# Altium project cyber60-alps.PrjPcb
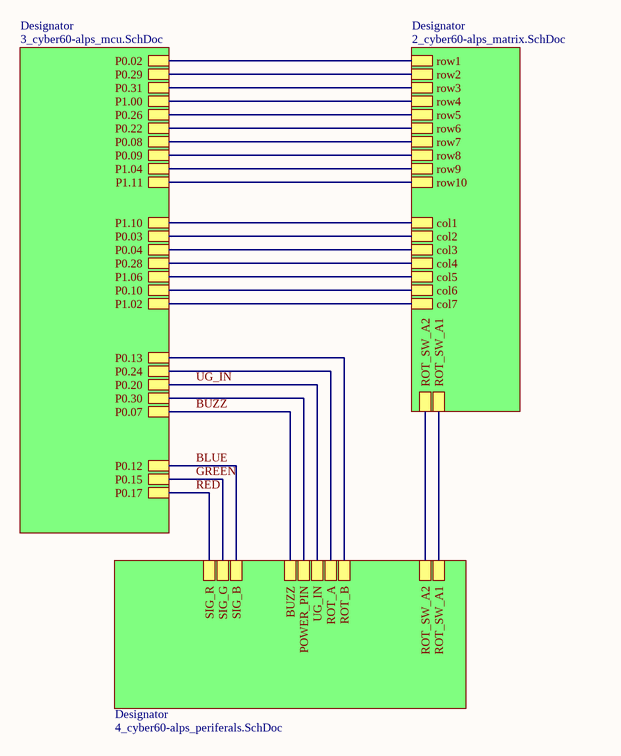
[diagram p0: 1_cyber60-alps_top.SchDoc]
ProjectTitle: cyber60; Revision: E1-ALPS
4 sheets, 243 parts. Net scope: hierarchical (ports join the sheet entries above them; power ports are global).
Board file: cyber60-alps.PcbDoc
Sheets:
  1_cyber60-alps_top.SchDoc
    Designator = 3_cyber60-alps_mcu.SchDoc
    Designator = 2_cyber60-alps_matrix.SchDoc
    Designator = 4_cyber60-alps_periferals.SchDoc

## Sheet 1_cyber60-alps_top.SchDoc: =ProjectTitle
size A4; Engineer: 4pplet; Address1: github.com/4pplet/cyber60; Address2: Licence: CERN-OHL-S; Revision: E1-ALPS; SheetNumber: 1; SheetTotal: 5; ProjectName: waffling60

### Sub-sheets
Designator = 3_cyber60-alps_mcu.SchDoc: P1.02, P1.04, P1.06, P1.11, P1.10, P0.07, P1.00, P0.22, P0.10, P0.09, P0.31, P0.29, P0.04, P0.02, P0.28, P0.20, P0.03, P0.26, P0.17, P0.15, P0.13, P0.24, P0.30, P0.12, P0.08
Designator = 2_cyber60-alps_matrix.SchDoc: col6, col5, col7, col3, col2, col1, col4, row3, row1, row4, row2, row5, row6, row9, row7, ROT_SW_A1, ROT_SW_A2, row8, row10
Designator = 4_cyber60-alps_periferals.SchDoc: ROT_SW_A2, ROT_B, ROT_A, ROT_SW_A1, POWER_PIN, BUZZ, SIG_B, SIG_R, SIG_G, UG_IN

### Nets
BLUE: sheet Designator/P0.12, sheet Designator/SIG_B
BUZZ: sheet Designator/P0.07, sheet Designator/BUZZ
col1: sheet Designator/P1.10, sheet Designator/col1
col2: sheet Designator/P0.03, sheet Designator/col2
col3: sheet Designator/P0.04, sheet Designator/col3
col4: sheet Designator/P0.28, sheet Designator/col4
col5: sheet Designator/P1.06, sheet Designator/col5
col6: sheet Designator/P0.10, sheet Designator/col6
col7: sheet Designator/P1.02, sheet Designator/col7, sheet Designator/ROT_SW_A2, sheet Designator/ROT_SW_A2
ENC_A: sheet Designator/P0.24, sheet Designator/ROT_A
ENC_B: sheet Designator/P0.13, sheet Designator/ROT_B
GREEN: sheet Designator/P0.15, sheet Designator/SIG_G
P0.02/AIN0: sheet Designator/P0.02, sheet Designator/row1
P0.08: sheet Designator/P0.08, sheet Designator/row7
P0.09/NFC1: sheet Designator/P0.09, sheet Designator/row8
P0.22: sheet Designator/P0.22, sheet Designator/row6
P0.26: sheet Designator/P0.26, sheet Designator/row5
P0.29/AIN5: sheet Designator/P0.29, sheet Designator/row2
P0.30/AIN6: sheet Designator/P0.30, sheet Designator/POWER_PIN
P0.31/AIN7: sheet Designator/P0.31, sheet Designator/row3
P1.00: sheet Designator/P1.00, sheet Designator/row4
P1.04: sheet Designator/P1.04, sheet Designator/row9
P1.11: sheet Designator/P1.11, sheet Designator/row10
RED: sheet Designator/P0.17, sheet Designator/SIG_R  [project net P0.17]
ROT_SW_A1: sheet Designator/ROT_SW_A1, sheet Designator/ROT_SW_A1
UG_IN: sheet Designator/P0.20, sheet Designator/UG_IN  [project net P0.20]

### Notes on the sheet
- Title
- Size:
- Date:
- A4
- Number:
- Time:
- Revision:
- Sheet
- of
- File:

## Sheet 3_cyber60-alps_mcu.SchDoc: =ProjectTitle
size A3; Address1: github.com/4pplet/cyber60; Address2: Licence: CERN-OHL-S; Revision: E1-ALPS; SheetNumber: 3; SheetTotal: 5
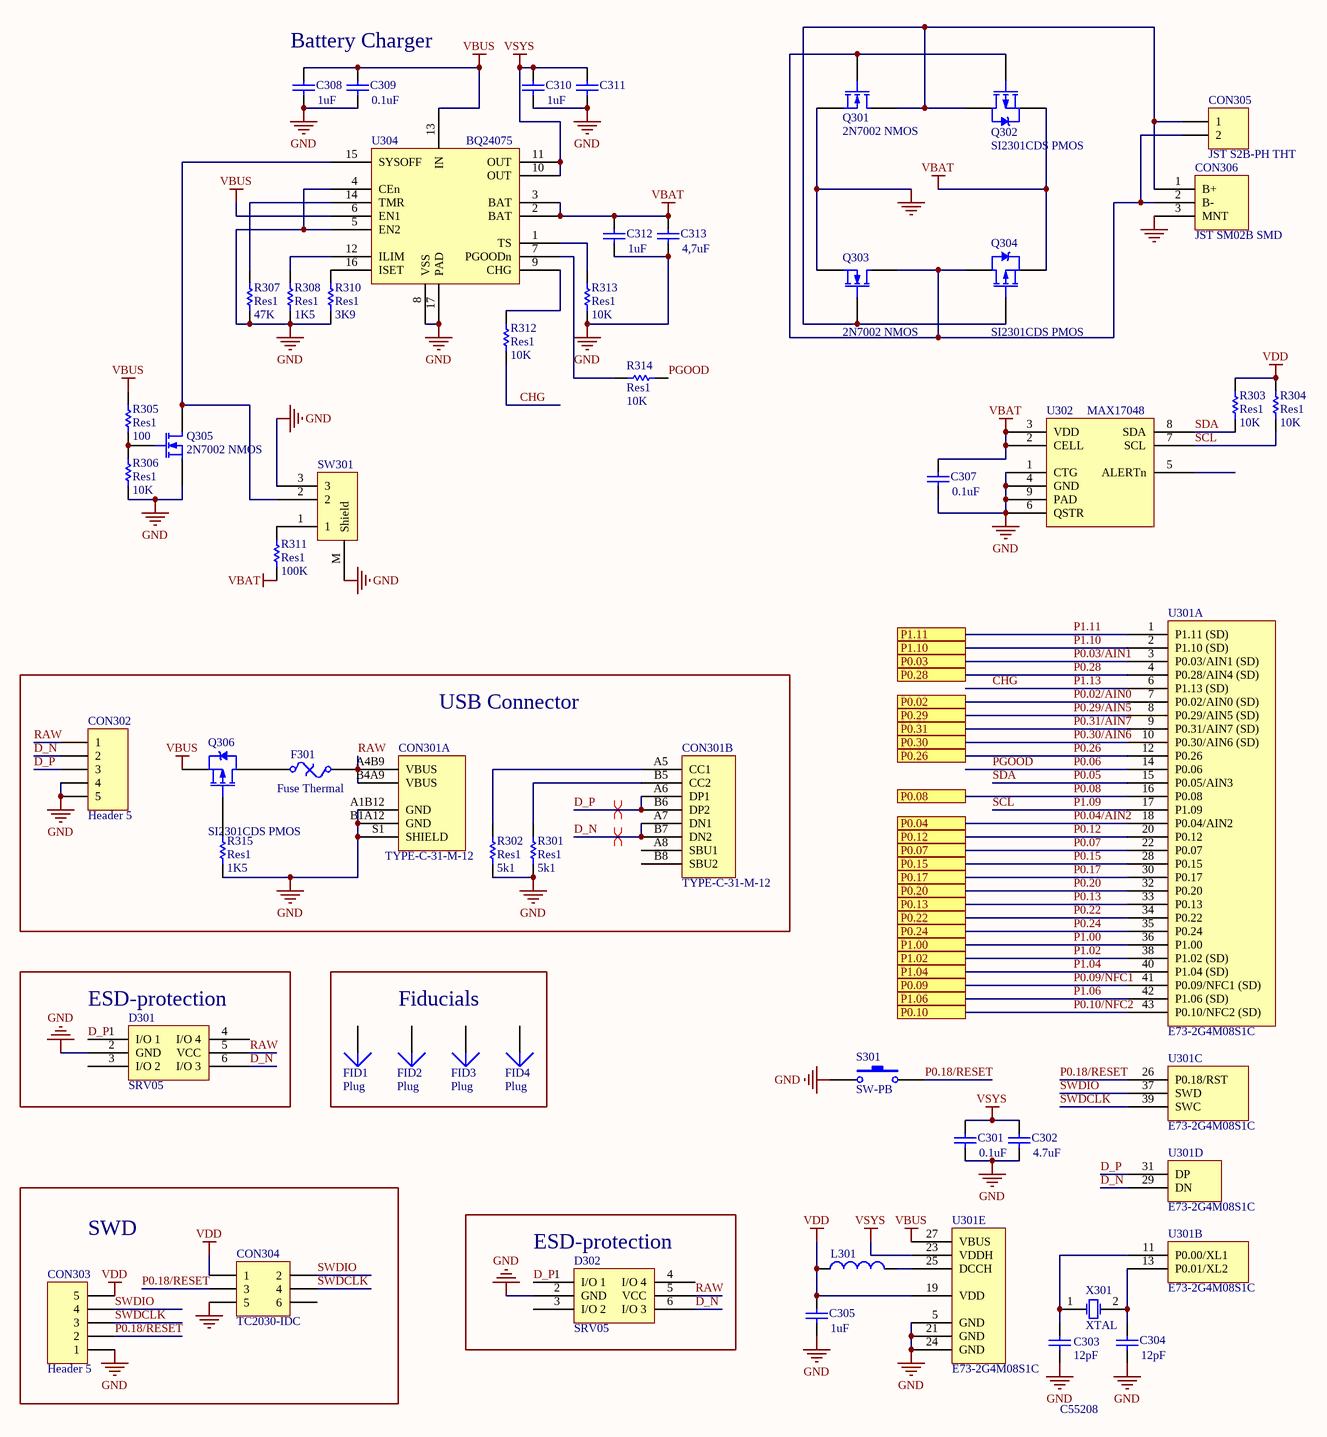
[diagram p1: 3_cyber60-alps_mcu.SchDoc]

### Parts
C301  value 0.1uF  [C0603[1608]]
C302  value 4.7uF  [C0603[1608]]
C303  value 12pF  [C0402[1005]]
C304  value 12pF  [C0402[1005]]
C305  value 1uF  [C0603[1608]]
C307  value 0.1uF  [C0603[1608]]
C308  value 1uF  [C0603[1608]]
C309  value 0.1uF  [C0603[1608]]
C310  value 1uF  [C0603[1608]]
C311  (no value)  [C0603[1608]]
C312  value 1uF  [C0603[1608]]
C313  value 4,7uF  [C0603[1608]]
CON301  TYPE-C-31-M-12  [TYPE-C-31-M-12]  (parts A,B of 2)
CON302  Header 5  [UDB_COMBO_JST_MOLEX]
CON303  Header 5  [HDR1X5]  (no BOM)
CON304  TC2030-IDC  [TC2030-IDC-NL]  (no BOM)
CON305  JST S2B-PH THT  [JST S2B-PH-K(LF)(SN)]  (no BOM)
CON306  JST SM02B SMD  [JST SM02B-SRSS-TB]
D301  SRV05  [SOT-23-6]
D302  SRV05  [SOT-23-6]
F301  Fuse Thermal  [C1206[3216]]
FID1  Plug  [Fiducial_Nordic]  (no BOM)
FID2  Plug  [Fiducial_Nordic]  (no BOM)
FID3  Plug  [Fiducial_Nordic]  (no BOM)
FID4  Plug  [Fiducial_Nordic]  (no BOM)
L301  Inductor  [L0603[1608]]  (value not drawn)
Q301  2N7002 NMOS  [SOT-23-3]
Q302  SI2301CDS PMOS  [SOT-23-3]
Q303  2N7002 NMOS  [SOT-23-3]
Q304  SI2301CDS PMOS  [SOT-23-3]
Q305  2N7002 NMOS  [SOT-23-3]
Q306  SI2301CDS PMOS  [SOT-23-3]
R301  Res1  value 5k1  [R0603[1608]]
R302  Res1  value 5k1  [R0603[1608]]
R303  Res1  value 10K  [R0603[1608]]
R304  Res1  value 10K  [R0603[1608]]
R305  Res1  value 100  [R0603[1608]]
R306  Res1  value 10K  [R0603[1608]]
R307  Res1  value 47K  [R0603[1608]]
R308  Res1  value 1K5  [R0603[1608]]
R310  Res1  value 3K9  [R0603[1608]]
R311  Res1  value 100K  [R0603[1608]]
R312  Res1  value 10K  [R0603[1608]]
R313  Res1  value 10K  [R0603[1608]]
R314  Res1  value 10K  [R0603[1608]]
R315  Res1  value 1K5  [R0603[1608]]
S301  SW-PB  [XKB Switch]
SW301  Korean Hroparts Elec K3-1296S-E2  [Korean Hroparts Elec K3-1296S-E2]  (value not drawn)
U301  E73-2G4M08S1C  [E73-2G4M08S1C]  (parts A,B,C,D,E of 5)
U302  MAX17048  [8TDFN]
U304  BQ24075  [QFN16]
X301  XTAL  [XTAL-2012]

### Blocks framed on the sheet
USB Connector: CON301 CON302 F301 Q306 R301 R302 R315
ESD-protection: D301
Fiducials: FID1-FID4
SWD: CON303 CON304
ESD-protection: D302

### Ports
P0.02, P0.03, P0.04, P0.07, P0.08, P0.09, P0.10, P0.12, P0.13, P0.15, P0.17, P0.20, P0.22, P0.24, P0.26, P0.28, P0.29, P0.30, P0.31, P1.00, P1.02, P1.04, P1.06, P1.10, P1.11

### Nets
GND: C301.1 C302.1 C303.1 C304.1 C305.1 C307.1 C308.1 C309.1 C310.1 C311.1 C312.1 C313.1 CON301.A1B12(GND) CON301.B1A12(GND) CON301.S1(SHIELD) CON302.4 CON302.5 CON303.1 CON304.5 CON306.3(MNT) D301.2(GND) D302.2(GND) Q301.2(S) Q303.2(S) Q305.2(S) R301.2 R302.2 R306.2 R307.2 R308.2 R310.2 R313.2 R315.2 S301.1 SW301.3 SW301.M(Shield) U301.5(GND) U301.21(GND) U301.24(GND) U302.1(CTG) U302.4(GND) U302.6(QSTR) U302.9(PAD) U304.4(CEn) U304.5(EN2) U304.8(VSS) U304.17(PAD)
VBAT: C307.2 C312.2 C313.2 Q302.2(S) Q304.2(S) R311.2 U302.2(CELL) U302.3(VDD) U304.2(BAT) U304.3(BAT)
VBUS: C308.2 C309.2 Q306.2(S) R305.1 U301.27(VBUS) U304.6(EN1) U304.13(IN)
VDD: C305.2 CON303.5 CON304.1 L301.1 R303.1 R304.1 U301.19(VDD)
VSYS: C301.2 C302.2 C310.2 C311.2 U301.23(VDDH) U304.10(OUT) U304.11(OUT)
CHG: R312.2 U301.6(P1.13_(SD))  [also labelled P1.13]
D_N: CON301.A7(DN1) CON301.B7(DN2) CON302.2 D301.6(I/O_3) D302.6(I/O_3) U301.29(DN)
D_P: CON301.A6(DP1) CON301.B6(DP2) CON302.3 D301.1(I/O_1) D302.1(I/O_1) U301.31(DP)
P0.02/AIN0: U301.7(P0.02/AIN0_(SD)) ; port P0.02
P0.03/AIN1: U301.3(P0.03/AIN1_(SD)) ; port P0.03  [project net col2]
P0.04/AIN2: U301.18(P0.04/AIN2) ; port P0.04  [project net col3]
P0.05: R303.2 U301.15(P0.05/AIN3) U302.8(SDA)  [also labelled SDA]
P0.06: R314.2 U301.14(P0.06)  [also labelled PGOOD]
P0.07: U301.22(P0.07) ; port P0.07  [project net BUZZ]
P0.08: U301.16(P0.08) ; port P0.08
P0.09/NFC1: U301.41(P0.09/NFC1_(SD)) ; port P0.09
P0.10/NFC2: U301.43(P0.10/NFC2_(SD)) ; port P0.10  [project net col6]
P0.12: U301.20(P0.12) ; port P0.12  [project net BLUE]
P0.13: U301.33(P0.13) ; port P0.13  [project net ENC_B]
P0.15: U301.28(P0.15) ; port P0.15  [project net GREEN]
P0.17: U301.30(P0.17) ; port P0.17
P0.18/RESET: CON303.2 CON304.3 S301.2 U301.26(P0.18/RST)
P0.20: U301.32(P0.20) ; port P0.20
P0.22: U301.34(P0.22) ; port P0.22
P0.24: U301.35(P0.24) ; port P0.24  [project net ENC_A]
P0.26: U301.12(P0.26) ; port P0.26
P0.28: U301.4(P0.28/AIN4_(SD)) ; port P0.28  [project net col4]
P0.29/AIN5: U301.8(P0.29/AIN5_(SD)) ; port P0.29
P0.30/AIN6: U301.10(P0.30/AIN6_(SD)) ; port P0.30
P0.31/AIN7: U301.9(P0.31/AIN7_(SD)) ; port P0.31
P1.00: U301.36(P1.00) ; port P1.00
P1.02: U301.38(P1.02_(SD)) ; port P1.02  [project net col7]
P1.04: U301.40(P1.04_(SD)) ; port P1.04
P1.06: U301.42(P1.06_(SD)) ; port P1.06  [project net col5]
P1.09: R304.2 U301.17(P1.09) U302.7(SCL)  [also labelled SCL]
P1.10: U301.2(P1.10_(SD)) ; port P1.10  [project net col1]
P1.11: U301.1(P1.11_(SD)) ; port P1.11
RAW: CON301.A4B9(VBUS) CON301.B4A9(VBUS) CON302.1 D301.5(VCC) D302.5(VCC) F301.2
SWDCLK: CON303.3 CON304.4 U301.39(SWC)
SWDIO: CON303.4 CON304.2 U301.37(SWD)
NetC303_2: C303.2 U301.11(P0.00/XL1) X301.1(OSC1)
NetC304_2: C304.2 U301.13(P0.01/XL2) X301.2(OSC2)
NetCON301_A5: CON301.A5(CC1) R302.1
NetCON301_B5: CON301.B5(CC2) R301.1
NetCON305_1: CON305.1 CON306.1(B+) Q301.3(D) Q302.3(D) Q303.1(G) Q304.1(G)
NetCON305_2: CON305.2 CON306.2(B-) Q301.1(G) Q302.1(G) Q303.3(D) Q304.3(D)
NetF301_1: F301.1 Q306.3(D)
NetL301_2: L301.2 U301.25(DCCH)
NetQ305_1: Q305.1(G) R305.2 R306.1
NetQ305_3: Q305.3(D) SW301.2 U304.15(SYSOFF)
NetQ306_1: Q306.1(G) R315.1
NetR307_1: R307.1 U304.14(TMR)
NetR308_1: R308.1 U304.12(ILIM)
NetR310_1: R310.1 U304.16(ISET)
NetR311_1: R311.1 SW301.1
NetR312_1: R312.1 U304.9(CHG)
NetR313_1: R313.1 U304.1(TS)
NetR314_1: R314.1 U304.7(PGOODn)

Not connected (* = marked no-connect by the designer): CON301 A8(SBU1) B8(SBU2); CON304 6; D301 3(I/O_2) 4(I/O_4); D302 3(I/O_2) 4(I/O_4); FID1 1; FID2 1; FID3 1; FID4 1; U302 5(ALERTn)

### Layout directives
differential pair: D_N, D_P

### Notes on the sheet
- Battery Charger
- C55208
- Title
- Size:
- Date:
- File:
- A0
- Number:
- Time:
- Revision:
- Sheet
- of

### Library data of the parts
C301 C307 C309 = Cap: Capacitor; MRF.Part: CC0603KRX7R9BB104; LCSC MFG: YAGEO; Version: 0603 imperial; LCSC Part #: C14663
C302 C311 C313 = Cap: Capacitor; MRF.Part: CL10A475KO8NNNC; LCSC MFG: Samsung Electro-Mechanics; LCSC Part #: C19666
  C302: Version: 0603 imperial
C303 C304 = Cap: Capacitor; MRF.Part: 0402CG120J500NT; LCSC MFG: FH (Guangdong Fenghua Advanced Tech); Version: 0402; LCSC Part #: C1547
C305 C308 C310 C312 = Cap: Capacitor; MRF.Part: CL10A105KB8NNNC; LCSC MFG: Samsung Electro-Mechanics; Version: 0603 imperial; LCSC Part #: C15849
CON301 = TYPE-C-31-M-12: MFG: Korean Hroparts Elec; MFGPN: TYPE-C-31-M-12; LCSC Part #: C165948; LCSC MFG: Korean Hroparts Elec; MRF.Part: TYPE-C-31-M-12
CON302 = Header 5: JST for USB daughter board; MFGPN: SM04B-SRSS-TB(LF)(SN); MFG: JST Sales America Inc.; LCSC MFG: JST Sales America; LCSC Part #: C160404; MRF.Part: SM04B-SRSS-TB(LF)(SN)
CON303 = Header 5: Header, 5-Pin
CON304 = Header 3X2: Header, 3-Pin, Dual row
CON305 = Header 2: Header, 2-Pin; MRF.Part: S2B-PH-K(LF)(SN); LCSC MFG: JST Sales America; LCSC Part #: C265016
CON306 = JST S2B-PH-SM4-TB: MRF.Part: SM02B-SRSS-TB(LF)(SN); LCSC MFG: JST Sales America; LCSC Part #: C160402
D301 D302 = SRV05: MRF.Part: SRV05-4-P-T7; LCSC MFG: ProTek Devices; LCSC Part #: C85364
F301 = Fuse Thermal: Thermal Fuse; MRF.Part: ASMD1206-050; MFG: Bel Fuse Inc.; MFGPN: 0ZCJ0050FF2G; LCSC MFG: Shenzhen JDT Fuse; LCSC Part #: C135338
L301 = Inductor: MRF.Part: CBMF1608T100K; LCSC MFG: Taiyo Yuden; LCSC Part #: C92982
Q301 Q303 Q305 = MOSFET-N: N-Channel MOSFET; LCSC MFG: Changjiang Electronics Tech (CJ); LCSC Part #: C8545; MRF.Part: 2N7002
Q302 Q304 Q306 = PMOS-2: P-Channel Power MOSFET; MRF.Part: SI2301CDS-T1-GE3; Note: Pin 4 not drawn and electrically connected to Pin 2.; LCSC MFG: Vishay Intertech; LCSC Part #: C10487
R301 R302 = Res1: Resistor; MRF.Part: 0603WAF5101T5E; MFG: Panasonic Electronic Components; MFGPN: ERJ-3EKF5101V; LCSC MFG: Uniroyal Elec; Version: 0603 imperial; LCSC Part #: C23186
R303 R304 R306 R311-R314 = Res1: Resistor; MRF.Part: 0603WAF1002T5E; LCSC MFG: Uniroyal Elec; Version: 0603 imperial; LCSC Part #: C25804
R305 = Res1: Resistor; MRF.Part: 0603WAF1000T5E; LCSC MFG: UNI-ROYAL(Uniroyal Elec); Version: 0603 imperial; LCSC Part #: C22775
R307 = Res1: Resistor; MRF.Part: 0603WAF4702T5E; LCSC MFG: UNI-ROYAL(Uniroyal Elec); Version: 0603 imperial; LCSC Part #: C25819
R308 R315 = Res1: Resistor; MRF.Part: 0603WAF1501T5E; LCSC MFG: UNI-ROYAL(Uniroyal Elec); Version: 0603 imperial; LCSC Part #: C22843
R310 = Res1: Resistor; MRF.Part: 0603WAF3901T5E; LCSC MFG: UNI-ROYAL(Uniroyal Elec); Version: 0603 imperial; LCSC Part #: C23018
S301 = SW-PB: Switch; MRF.Part: TS-1187A-C-D-B; LCSC MFG: XKB Enterprise; LCSC Part #: C318888
U301 = E73-2G4M08S1C: LCSC MFG: Chengdu Ebyte Elec Tech; LCSC Part #: C356849; MRF.Part: E73-2G4M08S1C
U302 = MAX17048: MRF.Part: MAX17048G+T10; LCSC MFG: Analog Devices Inc./Maxim Integrated; LCSC Part #: C2682616
U304 = BQ24075: MRF.Part: BQ24075RGTR; LCSC MFG: Texas Instruments; LCSC Part #: C15464
X301 = XTAL: Crystal Oscillator; MRF.Part: X1A0000610002; Value: 32.768KHz; LCSC MFG: Seiko Epson; Version: 3225, 18pF; LCSC Part #: C55208
SW301 = Korean Hroparts Elec K3-1296S-E2: LCSC MFG: Korean Hroparts Elec; LCSC Part #: C136659; MFGPN: K3-1296S-E2

## Sheet 2_cyber60-alps_matrix.SchDoc: =ProjectTitle
size A3; Address1: github.com/4pplet/cyber60; Address2: Licence: CERN-OHL-S; Revision: E1-ALPS; SheetNumber: 2; SheetTotal: 5
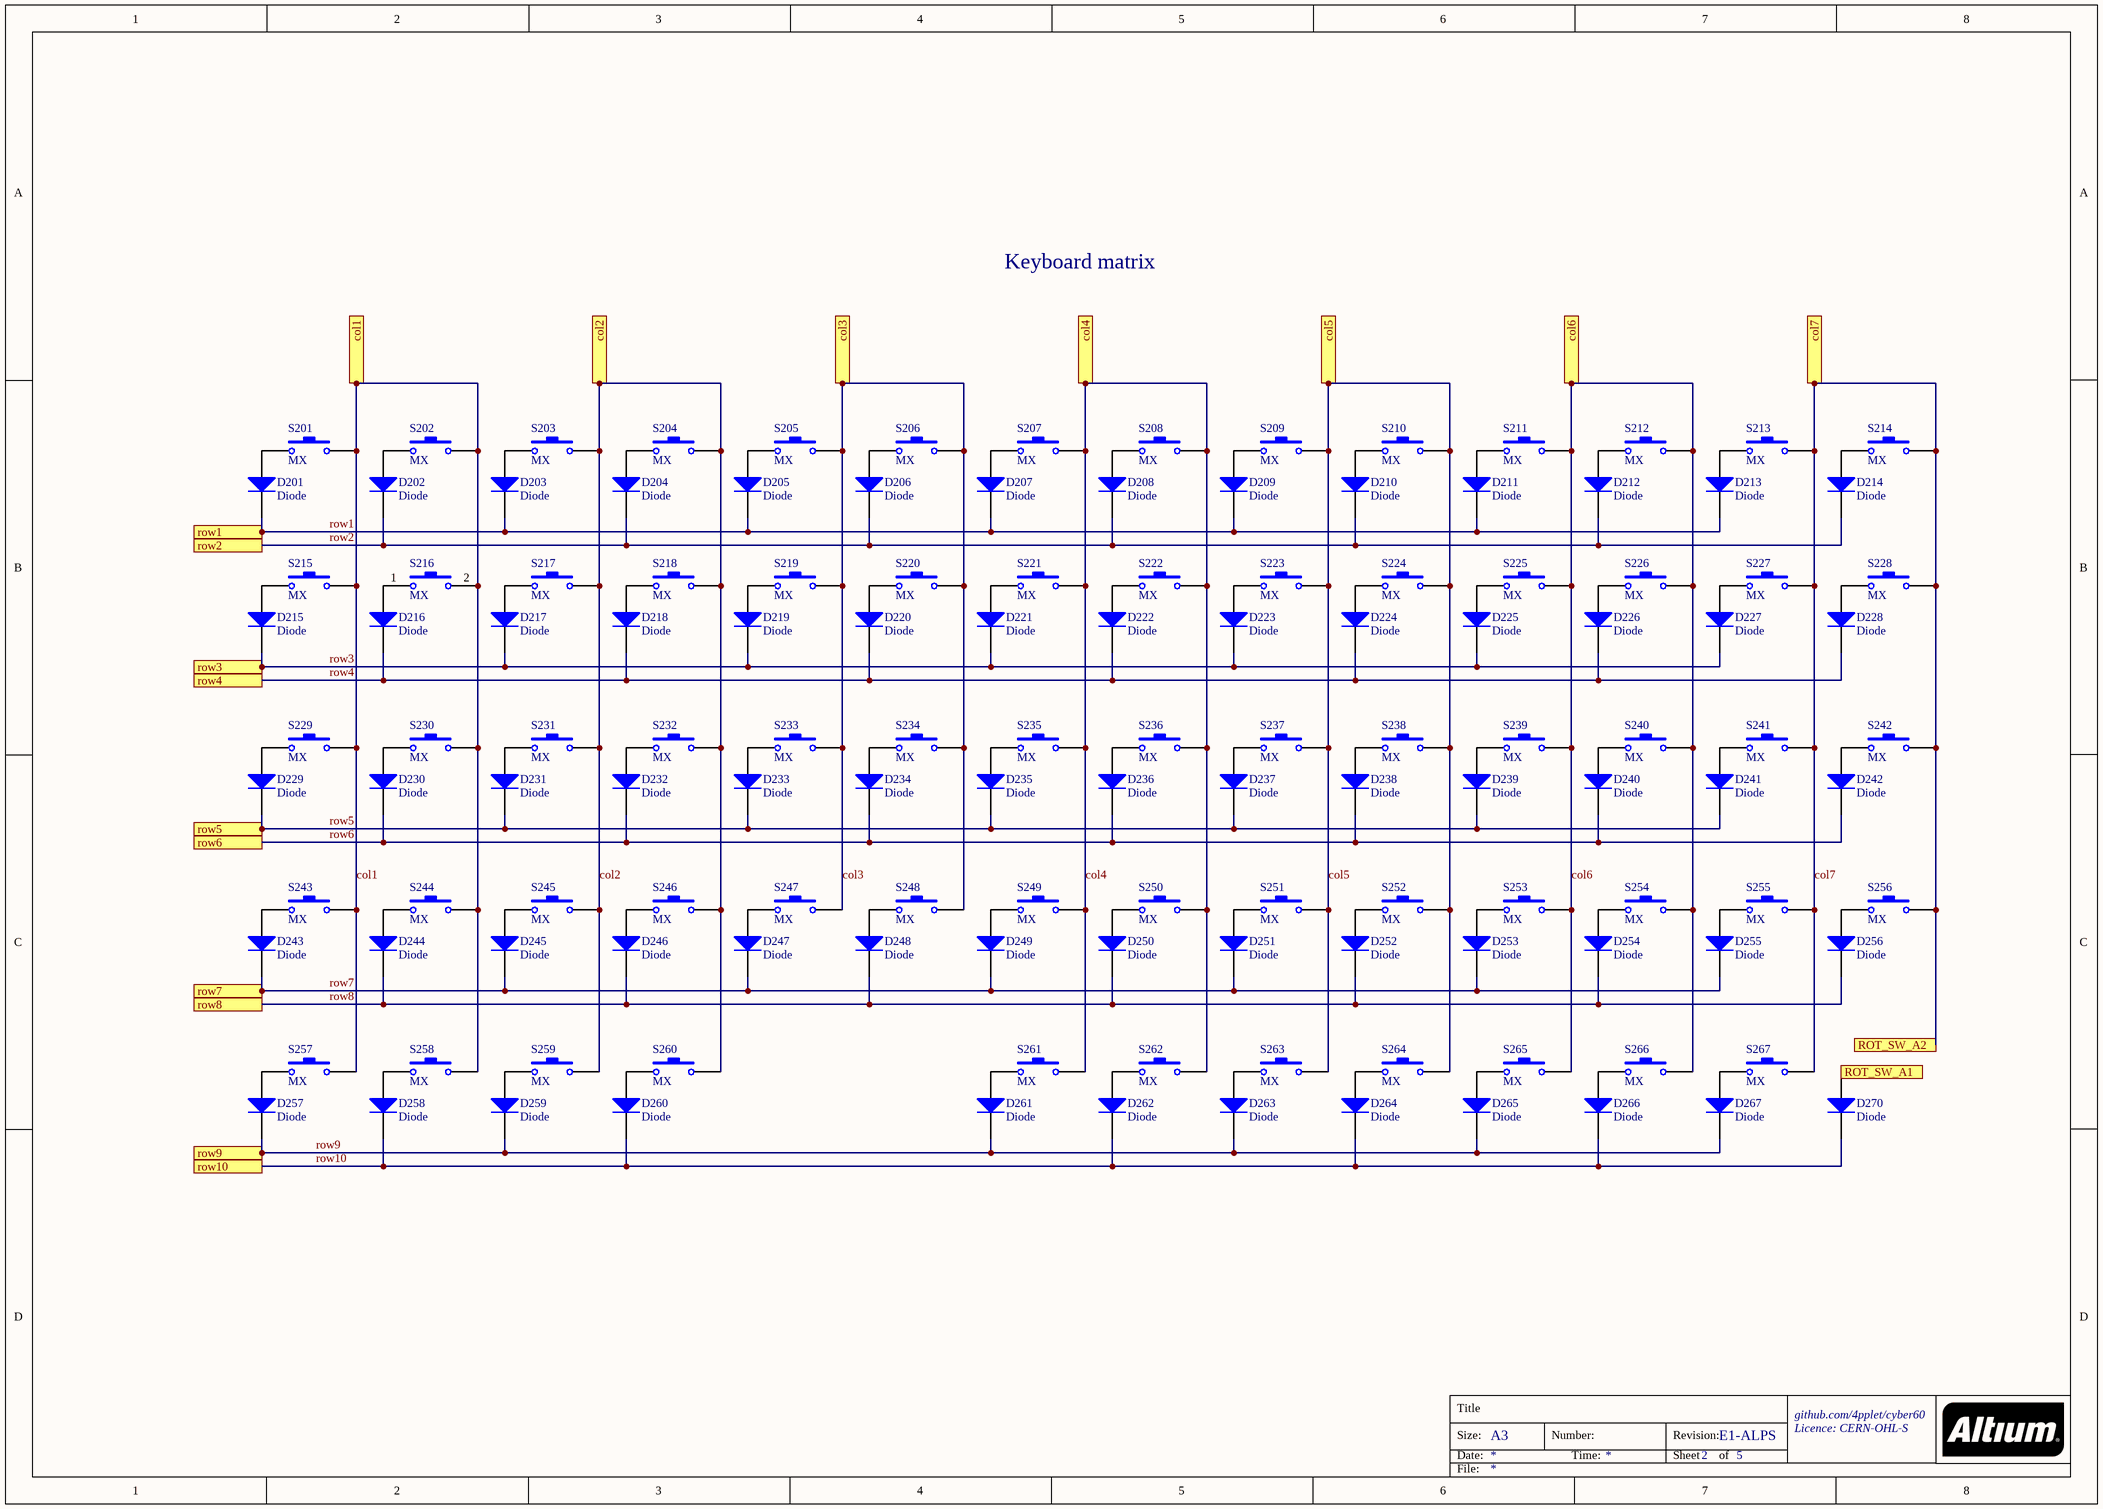
[diagram p2: 2_cyber60-alps_matrix.SchDoc]

### Parts
D201  Diode  [SOD-123]
D202  Diode  [SOD-123]
D203  Diode  [SOD-123]
D204  Diode  [SOD-123]
D205  Diode  [SOD-123]
D206  Diode  [SOD-123]
D207  Diode  [SOD-123]
D208  Diode  [SOD-123]
D209  Diode  [SOD-123]
D210  Diode  [SOD-123]
D211  Diode  [SOD-123]
D212  Diode  [SOD-123]
D213  Diode  [SOD-123]
D214  Diode  [SOD-123]
D215  Diode  [SOD-123]
D216  Diode  [SOD-123]
D217  Diode  [SOD-123]
D218  Diode  [SOD-123]
D219  Diode  [SOD-123]
D220  Diode  [SOD-123]
D221  Diode  [SOD-123]
D222  Diode  [SOD-123]
D223  Diode  [SOD-123]
D224  Diode  [SOD-123]
D225  Diode  [SOD-123]
D226  Diode  [SOD-123]
D227  Diode  [SOD-123]
D228  Diode  [SOD-123]
D229  Diode  [SOD-123]
D230  Diode  [SOD-123]
D231  Diode  [SOD-123]
D232  Diode  [SOD-123]
D233  Diode  [SOD-123]
D234  Diode  [SOD-123]
D235  Diode  [SOD-123]
D236  Diode  [SOD-123]
D237  Diode  [SOD-123]
D238  Diode  [SOD-123]
D239  Diode  [SOD-123]
D240  Diode  [SOD-123]
D241  Diode  [SOD-123]
D242  Diode  [SOD-123]
D243  Diode  [SOD-123]
D244  Diode  [SOD-123]
D245  Diode  [SOD-123]
D246  Diode  [SOD-123]
D247  Diode  [SOD-123]
D248  Diode  [SOD-123]
D249  Diode  [SOD-123]
D250  Diode  [SOD-123]
D251  Diode  [SOD-123]
D252  Diode  [SOD-123]
D253  Diode  [SOD-123]
D254  Diode  [SOD-123]
D255  Diode  [SOD-123]
D256  Diode  [SOD-123]
D257  Diode  [SOD-123]
D258  Diode  [SOD-123]
D259  Diode  [SOD-123]
D260  Diode  [SOD-123]
D261  Diode  [SOD-123]
D262  Diode  [SOD-123]
D263  Diode  [SOD-123]
D264  Diode  [SOD-123]
D265  Diode  [SOD-123]
D266  Diode  [SOD-123]
D267  Diode  [SOD-123]
D270  Diode  [SOD-123]
S201  MX  [Alps-switch - switched pol]  (no BOM)
S202  MX  [Alps-switch - switched pol]  (no BOM)
S203  MX  [Alps-switch - switched pol]  (no BOM)
S204  MX  [Alps-switch]  (no BOM)
S205  MX  [Alps-switch - switched pol]  (no BOM)
S206  MX  [Alps-switch - switched pol]  (no BOM)
S207  MX  [Alps-switch - switched pol]  (no BOM)
S208  MX  [Alps-switch - switched pol]  (no BOM)
S209  MX  [Alps-switch - switched pol]  (no BOM)
S210  MX  [Alps-switch - switched pol]  (no BOM)
S211  MX  [Alps-switch - switched pol]  (no BOM)
S212  MX  [Alps-switch - switched pol]  (no BOM)
S213  MX  [Alps-switch - switched pol]  (no BOM)
S214  MX  [Alps-switch - switched pol]  (no BOM)
S215  MX  [Alps-switch - switched pol]  (no BOM)
S216  MX  [Alps-switch - switched pol]  (no BOM)
S217  MX  [Alps-switch - switched pol]  (no BOM)
S218  MX  [Alps-switch - switched pol]  (no BOM)
S219  MX  [Alps-switch - switched pol]  (no BOM)
S220  MX  [Alps-switch]  (no BOM)
S221  MX  [Alps-switch - switched pol]  (no BOM)
S222  MX  [Alps-switch - switched pol]  (no BOM)
S223  MX  [Alps-switch - switched pol]  (no BOM)
S224  MX  [Alps-switch - switched pol]  (no BOM)
S225  MX  [Alps-switch - switched pol]  (no BOM)
S226  MX  [Alps-switch]  (no BOM)
S227  MX  [Alps-switch]  (no BOM)
S228  MX  [ALPS-switch - backspace]  (no BOM)
S229  MX  [ALPS-switch - CAPS]  (no BOM)
S230  MX  [Alps-switch - switched pol]  (no BOM)
S231  MX  [Alps-switch - switched pol]  (no BOM)
S232  MX  [Alps-switch - switched pol]  (no BOM)
S233  MX  [Alps-switch - switched pol]  (no BOM)
S234  MX  [Alps-switch]  (no BOM)
S235  MX  [Alps-switch - switched pol]  (no BOM)
S236  MX  [Alps-switch - switched pol]  (no BOM)
S237  MX  [Alps-switch - switched pol]  (no BOM)
S238  MX  [Alps-switch - switched pol]  (no BOM)
S239  MX  [Alps-switch]  (no BOM)
S240  MX  [Alps-switch - switched pol]  (no BOM)
S241  MX  [Alps-switch]  (no BOM)
S242  MX  [ALPS-switch - 1.5U]  (no BOM)
S243  MX  [ALPS-switch - Left shift v2]  (no BOM)
S244  MX  [Alps-switch - switched pol]  (no BOM)
S245  MX  [Alps-switch - switched pol]  (no BOM)
S246  MX  [Alps-switch - switched pol]  (no BOM)
S247  MX  [Alps-switch - switched pol]  (no BOM)
S248  MX  [Alps-switch]  (no BOM)
S249  MX  [Alps-switch - switched pol]  (no BOM)
S250  MX  [Alps-switch - switched pol]  (no BOM)
S251  MX  [Alps-switch - switched pol]  (no BOM)
S252  MX  [Alps-switch - switched pol]  (no BOM)
S253  MX  [Alps-switch - switched pol]  (no BOM)
S254  MX  [Alps-switch - switched pol]  (no BOM)
S255  MX  [Alps-switch]  (no BOM)
S256  MX  [ALPS-switch - Enter - rotated stab]  (no BOM)
S257  MX  [ALPS-switch - 1.5u MOD-L]  (no BOM)
S258  MX  [ALPS-switch - L_WIN - V3]  (no BOM)
S259  MX  [ALPS-SWITCH - L_ALT - V3]  (no BOM)
S260  MX  [ALPS-switch - 2.75U - Rotated stab]  (no BOM)
S261  MX  [ALPS-switch - Space_V2]  (no BOM)
S262  MX  [ALPS-switch - 2.75U - Rotated stab]  (no BOM)
S263  MX  [Alps-switch - switched pol]  (no BOM)
S264  MX  [ALPS-SWITCH - R_ALT - V3]  (no BOM)
S265  MX  [ALPS-switch - R_WIN V3]  (no BOM)
S266  MX  [ALPS-switch - 1.5u MOD-R]  (no BOM)
S267  MX  [ALPS-switch - right shift - stabs]  (no BOM)

### Ports
col1, col2, col3, col4, col5, col6, col7, ROT_SW_A1, ROT_SW_A2, row1, row2, row3, row4, row5, row6, row7, row8, row9, row10

### Nets
col1: S201.2 S202.2 S215.2 S216.2 S229.2 S230.2 S243.2 S244.2 S257.1 S258.2 ; port col1
col2: S203.2 S204.2 S217.2 S218.2 S231.2 S232.2 S245.2 S246.2 S259.2 S260.2 ; port col2
col3: S205.2 S206.2 S219.2 S220.2 S233.2 S234.2 S247.2 S248.2 ; port col3
col4: S207.2 S208.2 S221.2 S222.2 S235.2 S236.2 S249.2 S250.2 S261.1 S262.2 ; port col4
col5: S209.2 S210.2 S223.2 S224.2 S237.2 S238.2 S251.2 S252.2 S263.2 S264.1 ; port col5
col6: S211.2 S212.2 S225.2 S226.2 S239.2 S240.2 S253.2 S254.2 S265.2 S266.2 ; port col6
col7: S213.2 S214.2 S227.2 S228.1 S241.2 S242.2 S255.2 S256.2 S267.1 ; port col7, port ROT_SW_A2
ROT_SW_A1: D270.1(A) ; port ROT_SW_A1
row1: D201.2(K) D203.2(K) D205.2(K) D207.2(K) D209.2(K) D211.2(K) D213.2(K) ; port row1  [project net P0.02/AIN0]
row2: D202.2(K) D204.2(K) D206.2(K) D208.2(K) D210.2(K) D212.2(K) D214.2(K) ; port row2  [project net P0.29/AIN5]
row3: D215.2(K) D217.2(K) D219.2(K) D221.2(K) D223.2(K) D225.2(K) D227.2(K) ; port row3  [project net P0.31/AIN7]
row4: D216.2(K) D218.2(K) D220.2(K) D222.2(K) D224.2(K) D226.2(K) D228.2(K) ; port row4  [project net P1.00]
row5: D229.2(K) D231.2(K) D233.2(K) D235.2(K) D237.2(K) D239.2(K) D241.2(K) ; port row5  [project net P0.26]
row6: D230.2(K) D232.2(K) D234.2(K) D236.2(K) D238.2(K) D240.2(K) D242.2(K) ; port row6  [project net P0.22]
row7: D243.2(K) D245.2(K) D247.2(K) D249.2(K) D251.2(K) D253.2(K) D255.2(K) ; port row7  [project net P0.08]
row8: D244.2(K) D246.2(K) D248.2(K) D250.2(K) D252.2(K) D254.2(K) D256.2(K) ; port row8  [project net P0.09/NFC1]
row9: D257.2(K) D259.2(K) D261.2(K) D263.2(K) D265.2(K) D267.2(K) ; port row9  [project net P1.04]
row10: D258.2(K) D260.2(K) D262.2(K) D264.2(K) D266.2(K) D270.2(K) ; port row10  [project net P1.11]
NetD201_1: D201.1(A) S201.1
NetD202_1: D202.1(A) S202.1
NetD203_1: D203.1(A) S203.1
NetD204_1: D204.1(A) S204.1
NetD205_1: D205.1(A) S205.1
NetD206_1: D206.1(A) S206.1
NetD207_1: D207.1(A) S207.1
NetD208_1: D208.1(A) S208.1
NetD209_1: D209.1(A) S209.1
NetD210_1: D210.1(A) S210.1
NetD211_1: D211.1(A) S211.1
NetD212_1: D212.1(A) S212.1
NetD213_1: D213.1(A) S213.1
NetD214_1: D214.1(A) S214.1
NetD215_1: D215.1(A) S215.1
NetD216_1: D216.1(A) S216.1
NetD217_1: D217.1(A) S217.1
NetD218_1: D218.1(A) S218.1
NetD219_1: D219.1(A) S219.1
NetD220_1: D220.1(A) S220.1
NetD221_1: D221.1(A) S221.1
NetD222_1: D222.1(A) S222.1
NetD223_1: D223.1(A) S223.1
NetD224_1: D224.1(A) S224.1
NetD225_1: D225.1(A) S225.1
NetD226_1: D226.1(A) S226.1
NetD227_1: D227.1(A) S227.1
NetD228_1: D228.1(A) S228.2
NetD229_1: D229.1(A) S229.1
NetD230_1: D230.1(A) S230.1
NetD231_1: D231.1(A) S231.1
NetD232_1: D232.1(A) S232.1
NetD233_1: D233.1(A) S233.1
NetD234_1: D234.1(A) S234.1
NetD235_1: D235.1(A) S235.1
NetD236_1: D236.1(A) S236.1
NetD237_1: D237.1(A) S237.1
NetD238_1: D238.1(A) S238.1
NetD239_1: D239.1(A) S239.1
NetD240_1: D240.1(A) S240.1
NetD241_1: D241.1(A) S241.1
NetD242_1: D242.1(A) S242.1
NetD243_1: D243.1(A) S243.1
NetD244_1: D244.1(A) S244.1
NetD245_1: D245.1(A) S245.1
NetD246_1: D246.1(A) S246.1
NetD247_1: D247.1(A) S247.1
NetD248_1: D248.1(A) S248.1
NetD249_1: D249.1(A) S249.1
NetD250_1: D250.1(A) S250.1
NetD251_1: D251.1(A) S251.1
NetD252_1: D252.1(A) S252.1
NetD253_1: D253.1(A) S253.1
NetD254_1: D254.1(A) S254.1
NetD255_1: D255.1(A) S255.1
NetD256_1: D256.1(A) S256.1
NetD257_1: D257.1(A) S257.2
NetD258_1: D258.1(A) S258.1
NetD259_1: D259.1(A) S259.1
NetD260_1: D260.1(A) S260.1
NetD261_1: D261.1(A) S261.2
NetD262_1: D262.1(A) S262.1
NetD263_1: D263.1(A) S263.1
NetD264_1: D264.1(A) S264.2
NetD265_1: D265.1(A) S265.1
NetD266_1: D266.1(A) S266.1
NetD267_1: D267.1(A) S267.2

### Notes on the sheet
- Keyboard matrix
- Title
- Size:
- Date:
- A3
- Number:
- Time:
- Revision:
- Sheet
- of
- File:

### Library data of the parts
D201-D267 D270 = Diode: Default Diode; MRF.Part: 1N4148W; LCSC MFG: ST(Semtech); Version: SOD-123; LCSC Part #: C81598
S201-S214 S216-S267 = SW-PB: Switch
S215 = SW-PB: TAB

## Sheet 4_cyber60-alps_periferals.SchDoc: =ProjectTitle
size A4; Address1: github.com/4pplet/cyber60; Address2: Licence: CERN-OHL-S; Revision: E1-ALPS; SheetNumber: 5; SheetTotal: 5
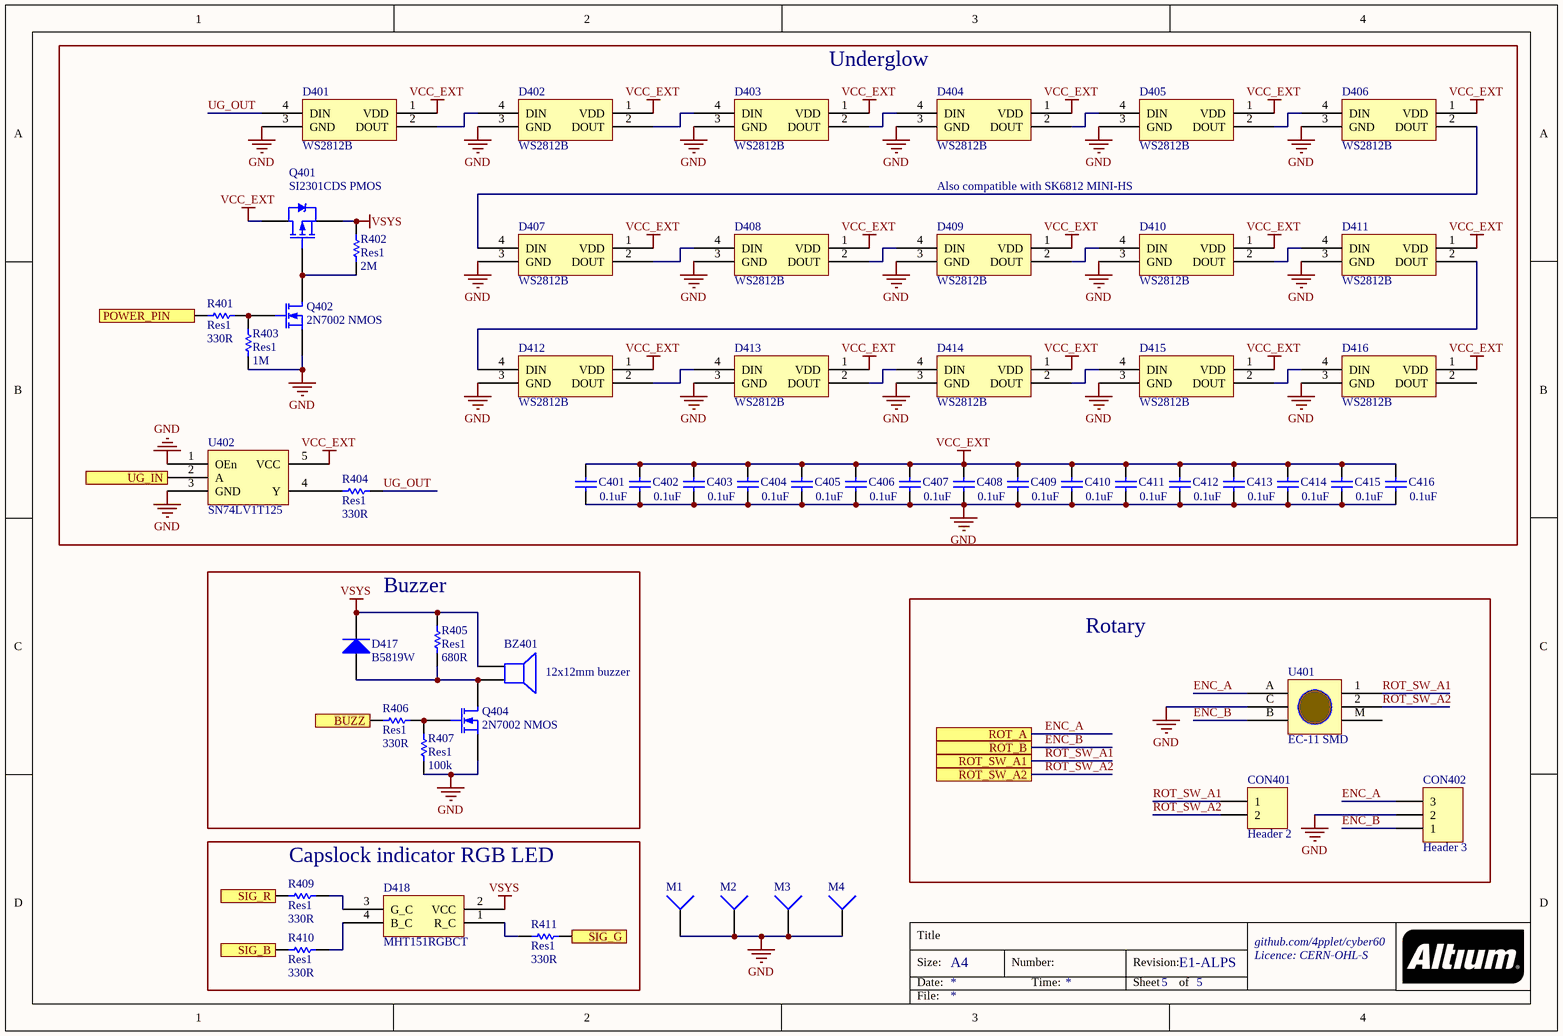
[diagram p3: 4_cyber60-alps_periferals.SchDoc]

### Parts
BZ401  12x12mm buzzer  [buzzer 12x12]
C401  value 0.1uF  [C0603[1608]]
C402  value 0.1uF  [C0603[1608]]
C403  value 0.1uF  [C0603[1608]]
C404  value 0.1uF  [C0603[1608]]
C405  value 0.1uF  [C0603[1608]]
C406  value 0.1uF  [C0603[1608]]
C407  value 0.1uF  [C0603[1608]]
C408  value 0.1uF  [C0603[1608]]
C409  value 0.1uF  [C0603[1608]]
C410  value 0.1uF  [C0603[1608]]
C411  value 0.1uF  [C0603[1608]]
C412  value 0.1uF  [C0603[1608]]
C413  value 0.1uF  [C0603[1608]]
C414  value 0.1uF  [C0603[1608]]
C415  value 0.1uF  [C0603[1608]]
C416  value 0.1uF  [C0603[1608]]
CON401  Header 2  [HDR1X2]  (no BOM)
CON402  Header 3  [HDR1X3]  (no BOM)
D401  WS2812B  [WS2812B - 2020]
D402  WS2812B  [WS2812B - 2020]
D403  WS2812B  [WS2812B - 2020]
D404  WS2812B  [WS2812B - 2020]
D405  WS2812B  [WS2812B - 2020]
D406  WS2812B  [WS2812B - 2020]
D407  WS2812B  [WS2812B - 2020]
D408  WS2812B  [WS2812B - 2020]
D409  WS2812B  [WS2812B - 2020]
D410  WS2812B  [WS2812B - 2020]
D411  WS2812B  [WS2812B - 2020]
D412  WS2812B  [WS2812B - 2020]
D413  WS2812B  [WS2812B - 2020]
D414  WS2812B  [WS2812B - 2020]
D415  WS2812B  [WS2812B - 2020]
D416  WS2812B  [WS2812B - 2020]
D417  B5819W  [SOD-123]
D418  MHT151RGBCT  [MHT151RGBCT]
M1  Socket  [mounting_hole]  (value not drawn)  (no BOM)
M2  Socket  [mounting_hole]  (value not drawn)  (no BOM)
M3  Socket  [mounting_hole]  (value not drawn)  (no BOM)
M4  Socket  [mounting_hole]  (value not drawn)  (no BOM)
Q401  SI2301CDS PMOS  [SOT-23-3]
Q402  2N7002 NMOS  [SOT-23-3]
Q404  2N7002 NMOS  [SOT-23-3]
R401  Res1  value 330R  [R0603[1608]]
R402  Res1  value 2M  [R0603[1608]]
R403  Res1  value 1M  [R0603[1608]]
R404  Res1  value 330R  [R0603[1608]]
R405  Res1  value 680R  [R0603[1608]]
R406  Res1  value 330R  [R0603[1608]]
R407  Res1  value 100k  [R0603[1608]]
R409  Res1  value 330R  [R0603[1608]]
R410  Res1  value 330R  [R0603[1608]]
R411  Res1  value 330R  [R0603[1608]]
U401  EC-11 SMD  [EC11-SMD]
U402  SN74LV1T125  [SOT-23-5]

### Blocks framed on the sheet
Underglow: C401-C416 D401-D416 Q401 Q402 R401-R404 U402
Buzzer: BZ401 D417 Q404 R405-R407
Rotary: CON401 CON402 U401
Capslock indicator RGB LED: D418 R409-R411

### Ports
BUZZ, POWER_PIN, ROT_A, ROT_B, ROT_SW_A1, ROT_SW_A2, SIG_B, SIG_G, SIG_R, UG_IN

### Nets
GND: C401.1 C402.1 C403.1 C404.1 C405.1 C406.1 C407.1 C408.1 C409.1 C410.1 C411.1 C412.1 C413.1 C414.1 C415.1 C416.1 CON402.2 D401.3(GND) D402.3(GND) D403.3(GND) D404.3(GND) D405.3(GND) D406.3(GND) D407.3(GND) D408.3(GND) D409.3(GND) D410.3(GND) D411.3(GND) D412.3(GND) D413.3(GND) D414.3(GND) D415.3(GND) D416.3(GND) M1.1 M2.1 M3.1 M4.1 Q402.2(S) Q404.2(S) R403.2 R407.2 U401.C U402.1(OEn) U402.3(GND)
VCC_EXT: C401.2 C402.2 C403.2 C404.2 C405.2 C406.2 C407.2 C408.2 C409.2 C410.2 C411.2 C412.2 C413.2 C414.2 C415.2 C416.2 D401.1(VDD) D402.1(VDD) D403.1(VDD) D404.1(VDD) D405.1(VDD) D406.1(VDD) D407.1(VDD) D408.1(VDD) D409.1(VDD) D410.1(VDD) D411.1(VDD) D412.1(VDD) D413.1(VDD) D414.1(VDD) D415.1(VDD) D416.1(VDD) Q401.3(D) U402.5(VCC)
VSYS: BZ401.1 D417.2(K) D418.2(VCC) Q401.2(S) R402.2 R405.1
BLUE: R410.2 ; port SIG_B
BUZZ: R406.2 ; port BUZZ
ENC_A: CON402.3 U401.A(B) ; port ROT_A
ENC_B: CON402.1 U401.B ; port ROT_B
GREEN: R411.1 ; port SIG_G
P0.17: R409.2 ; port SIG_R
P0.20: U402.2(A) ; port UG_IN
P0.30/AIN6: R401.1 ; port POWER_PIN
ROT_SW_A1: CON401.1 U401.1 ; port ROT_SW_A1
ROT_SW_A2: CON401.2 U401.2 ; port ROT_SW_A2  [project net col7]
UG_OUT: D401.4(DIN) R404.1
NetBZ401_2: BZ401.2 D417.1(A) Q404.3(D) R405.2
NetD401_2: D401.2(DOUT) D402.4(DIN)
NetD402_2: D402.2(DOUT) D403.4(DIN)
NetD403_2: D403.2(DOUT) D404.4(DIN)
NetD404_2: D404.2(DOUT) D405.4(DIN)
NetD405_2: D405.2(DOUT) D406.4(DIN)
NetD406_2: D406.2(DOUT) D407.4(DIN)
NetD407_2: D407.2(DOUT) D408.4(DIN)
NetD408_2: D408.2(DOUT) D409.4(DIN)
NetD409_2: D409.2(DOUT) D410.4(DIN)
NetD410_2: D410.2(DOUT) D411.4(DIN)
NetD411_2: D411.2(DOUT) D412.4(DIN)
NetD412_2: D412.2(DOUT) D413.4(DIN)
NetD413_2: D413.2(DOUT) D414.4(DIN)
NetD414_2: D414.2(DOUT) D415.4(DIN)
NetD415_2: D415.2(DOUT) D416.4(DIN)
NetD418_1: D418.1(R_C) R411.2
NetD418_3: D418.3(G_C) R409.1
NetD418_4: D418.4(B_C) R410.1
NetQ401_1: Q401.1(G) Q402.3(D) R402.1
NetQ402_1: Q402.1(G) R401.2 R403.1
NetQ404_1: Q404.1(G) R406.1 R407.1
NetR404_2: R404.2 U402.4(Y)

Not connected (* = marked no-connect by the designer): D416 2(DOUT); U401 M

### Notes on the sheet
- Also compatible with SK6812 MINI-HS
- Title
- Size:
- Date:
- A4
- Number:
- Time:
- Revision:
- Sheet
- of
- File:

### Library data of the parts
BZ401 = Speaker: Loudspeaker; MRF.Part: YS-SBZ1230; LCSC MFG: Fengming; LCSC Part #: C409829
C401-C416 = Cap: Capacitor; MRF.Part: CC0603KRX7R9BB104; MFG: KEMET; MFGPN: C0603C104M5RACTU; LCSC MFG: YAGEO; Version: 0603 imperial; LCSC Part #: C14663
CON401 = Header 2: Header, 2-Pin
CON402 = Header 3: Header, 3-Pin
D401-D416 = WS2812B: MRF.Part: WS2812C-2020; LCSC MFG: Worldsemi; LCSC Part #: C965556
D417 = Diode: Default Diode; LCSC MFG: Changjiang Electronics Tech (CJ); Version: SOD-123; LCSC Part #: C8598; MRF.Part: B5819W
D418 = MHT151RGBCT: MRF.Part: E6CC1205RGBC3UDA; LCSC MFG: EKINGLUX; LCSC Part #: C2802677
Q401 = PMOS-2: as Q302 on sheet 3_cyber60-alps_mcu; LCSC Part #: C10487
Q402 Q404 = MOSFET-N: as Q301 on sheet 3_cyber60-alps_mcu; LCSC Part #: C8545; MRF.Part: 2N7002
R401 R404 R406 R409-R411 = Res1: Resistor; MRF.Part: 0603WAF3300T5E; LCSC MFG: Uniroyal Elec; Version: 0603 imperial; LCSC Part #: C23138
R402 = Res1: Resistor; MRF.Part: 0603WAF2004T5E; LCSC MFG: Uniroyal Elec; Version: 0603 imperial; LCSC Part #: C22976
R403 = Res1: Resistor; MRF.Part: 0603WAF1004T5E; LCSC MFG: Uniroyal Elec; Version: 0603 imperial; LCSC Part #: C22935
R405 = Res1: Resistor; MRF.Part: 0603WAF6800T5E; LCSC MFG: Uniroyal Elec; Version: 0603 imperial; LCSC Part #: C23228
R407 = Res1: Resistor; MRF.Part: 0603WAF1003T5E; LCSC MFG: Uniroyal Elec; Version: 0603 imperial; LCSC Part #: C25803
U401 = EC-11
U402 = SN74LV1T125: SN74LV1T125 or SN74LV1T34. Connect OE to GND; MRF.Part: SN74LV1T125DBVR; LCSC MFG: Texas Instruments; LCSC Part #: C473338; Version: SOT-23
M1-M4 = Socket: LatestRevisionDate: 17-Jul-2002; LatestRevisionNote: Re-released for DXP Platform.; Publisher: Altium Limited

## Nets that join several sheets
GND: 3_cyber60-alps_mcu (47 pins), 4_cyber60-alps_periferals (44 pins)
VSYS: 3_cyber60-alps_mcu (7 pins), 4_cyber60-alps_periferals (6 pins)
BLUE: 3_cyber60-alps_mcu (U301.20), 4_cyber60-alps_periferals (R410.2)
BUZZ: 3_cyber60-alps_mcu (U301.22), 4_cyber60-alps_periferals (R406.2)
col1: 3_cyber60-alps_mcu (U301.2), 2_cyber60-alps_matrix (10 pins)
col2: 3_cyber60-alps_mcu (U301.3), 2_cyber60-alps_matrix (10 pins)
col3: 3_cyber60-alps_mcu (U301.18), 2_cyber60-alps_matrix (8 pins)
col4: 3_cyber60-alps_mcu (U301.4), 2_cyber60-alps_matrix (10 pins)
col5: 3_cyber60-alps_mcu (U301.42), 2_cyber60-alps_matrix (10 pins)
col6: 3_cyber60-alps_mcu (U301.43), 2_cyber60-alps_matrix (10 pins)
col7: 3_cyber60-alps_mcu (U301.38), 2_cyber60-alps_matrix (9 pins), 4_cyber60-alps_periferals (CON401.2 U401.2)
ENC_A: 3_cyber60-alps_mcu (U301.35), 4_cyber60-alps_periferals (CON402.3 U401.A)
ENC_B: 3_cyber60-alps_mcu (U301.33), 4_cyber60-alps_periferals (CON402.1 U401.B)
GREEN: 3_cyber60-alps_mcu (U301.28), 4_cyber60-alps_periferals (R411.1)
P0.02/AIN0: 3_cyber60-alps_mcu (U301.7), 2_cyber60-alps_matrix (7 pins)
P0.08: 3_cyber60-alps_mcu (U301.16), 2_cyber60-alps_matrix (7 pins)
P0.09/NFC1: 3_cyber60-alps_mcu (U301.41), 2_cyber60-alps_matrix (7 pins)
P0.17: 3_cyber60-alps_mcu (U301.30), 4_cyber60-alps_periferals (R409.2)
P0.20: 3_cyber60-alps_mcu (U301.32), 4_cyber60-alps_periferals (U402.2)
P0.22: 3_cyber60-alps_mcu (U301.34), 2_cyber60-alps_matrix (7 pins)
P0.26: 3_cyber60-alps_mcu (U301.12), 2_cyber60-alps_matrix (7 pins)
P0.29/AIN5: 3_cyber60-alps_mcu (U301.8), 2_cyber60-alps_matrix (7 pins)
P0.30/AIN6: 3_cyber60-alps_mcu (U301.10), 4_cyber60-alps_periferals (R401.1)
P0.31/AIN7: 3_cyber60-alps_mcu (U301.9), 2_cyber60-alps_matrix (7 pins)
P1.00: 3_cyber60-alps_mcu (U301.36), 2_cyber60-alps_matrix (7 pins)
P1.04: 3_cyber60-alps_mcu (U301.40), 2_cyber60-alps_matrix (6 pins)
P1.11: 3_cyber60-alps_mcu (U301.1), 2_cyber60-alps_matrix (6 pins)
ROT_SW_A1: 2_cyber60-alps_matrix (D270.1), 4_cyber60-alps_periferals (CON401.1 U401.1)

## Assembly variants
All: all parts fitted
Bakeneko: not fitted CON301 D301 R301 R302
Tray: not fitted CON303 D302